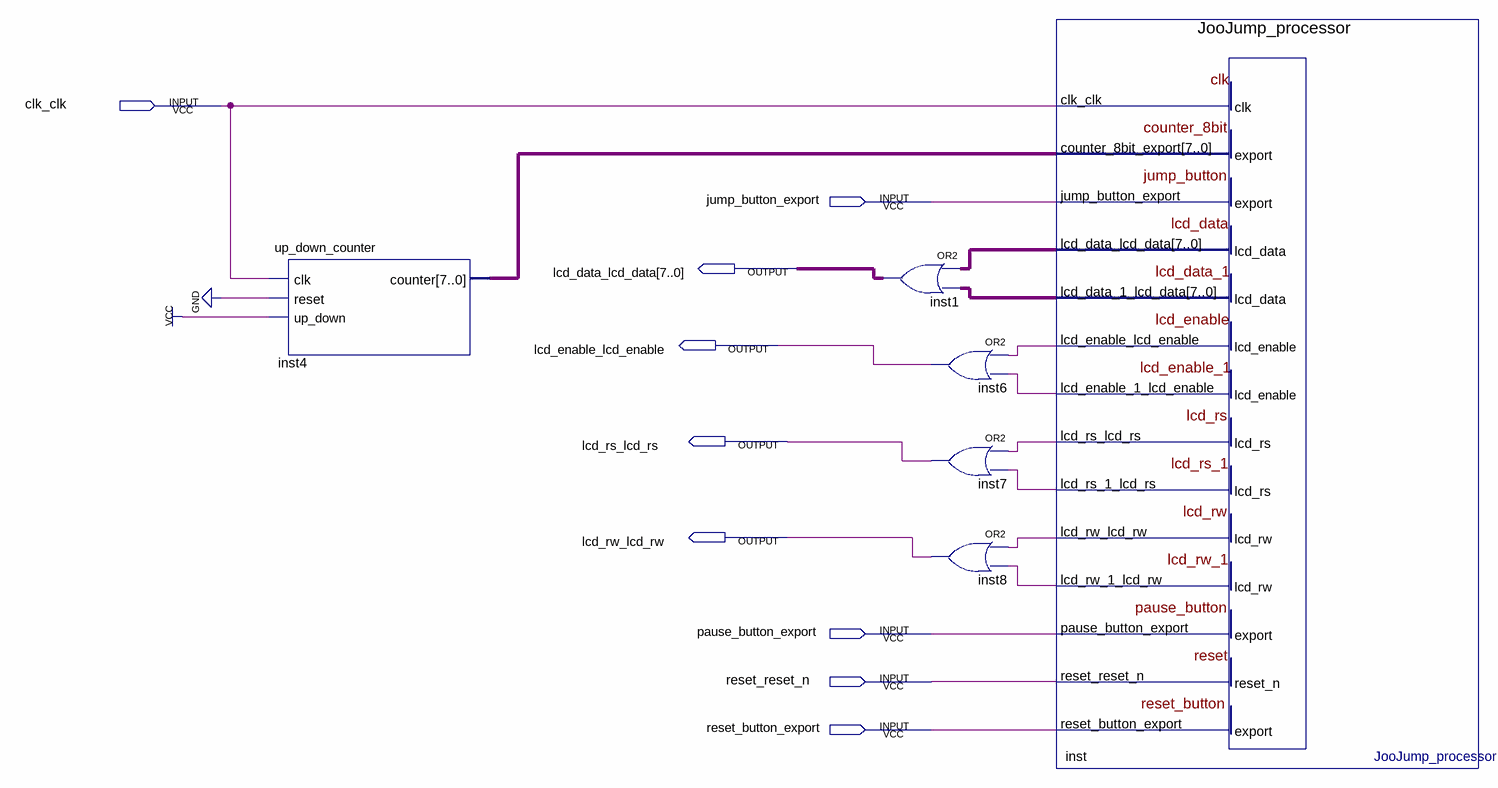
[diagram p0: schematic sheet]
// Quartus schematic JooJump.bdf as structural Verilog: 6 symbols, 9 pins
module JooJump (
  input  clk_clk,
  input  jump_button_export,
  input  pause_button_export,
  input  reset_reset_n,
  input  reset_button_export,
  output [7:0] lcd_data_lcd_data,
  output lcd_enable_lcd_enable,
  output lcd_rs_lcd_rs,
  output lcd_rw_lcd_rw
);

  wire inst_lcd_enable_1_lcd_enable, inst_lcd_enable_lcd_enable, inst_lcd_rs_1_lcd_rs, inst_lcd_rs_lcd_rs,
       inst_lcd_rw_1_lcd_rw, inst_lcd_rw_lcd_rw;
  wire [7:0] inst4_counter, inst_lcd_data_1_lcd_data, inst_lcd_data_lcd_data;

  up_down_counter inst4 (.clk(clk_clk), .reset(1'b0), .up_down(1'b1), .counter(inst4_counter));
  assign lcd_data_lcd_data = inst_lcd_data_lcd_data | inst_lcd_data_1_lcd_data;  // OR2 inst1, 8 bits wide
  or inst6 (lcd_enable_lcd_enable, inst_lcd_enable_lcd_enable, inst_lcd_enable_1_lcd_enable);
  or inst7 (lcd_rs_lcd_rs, inst_lcd_rs_lcd_rs, inst_lcd_rs_1_lcd_rs);
  or inst8 (lcd_rw_lcd_rw, inst_lcd_rw_lcd_rw, inst_lcd_rw_1_lcd_rw);
  JooJump_processor inst (
    .clk_clk(clk_clk), .counter_8bit_export(inst4_counter), .jump_button_export(jump_button_export),
    .pause_button_export(pause_button_export), .reset_reset_n(reset_reset_n),
    .reset_button_export(reset_button_export), .lcd_data_lcd_data(inst_lcd_data_lcd_data),
    .lcd_data_1_lcd_data(inst_lcd_data_1_lcd_data), .lcd_enable_lcd_enable(inst_lcd_enable_lcd_enable),
    .lcd_enable_1_lcd_enable(inst_lcd_enable_1_lcd_enable), .lcd_rs_lcd_rs(inst_lcd_rs_lcd_rs),
    .lcd_rs_1_lcd_rs(inst_lcd_rs_1_lcd_rs), .lcd_rw_lcd_rw(inst_lcd_rw_lcd_rw),
    .lcd_rw_1_lcd_rw(inst_lcd_rw_1_lcd_rw));
endmodule
